# EAGLE design Powerswitch MUR3060 (EAGLE 9.6.2)
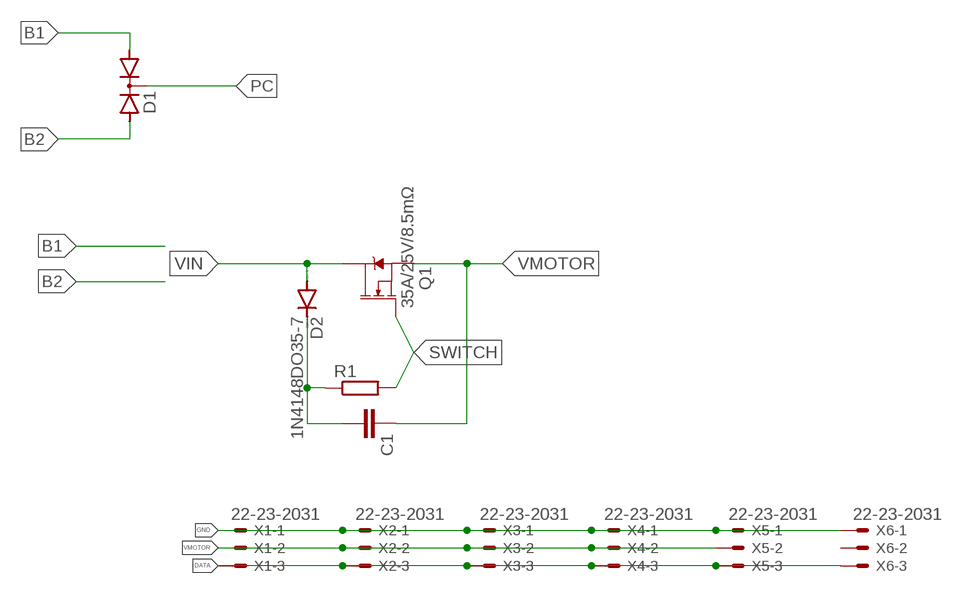
[diagram p0: schematic, sheet 1]

## Parts
C1  C-EU025-030X050  [C025-030X050]
D1  DIODE-2AC|CATO220H  [TO220AB]
D2  1N4148DO35-7  [DO35-7]
Q1  35A/25V/8.5mΩ  MOSFET-NCH-FDD8780  [DPAK]
R1  R-EU_0207/10  [0207/10]
X1  22-23-2031  [22-23-2031]
X2  22-23-2031  [22-23-2031]
X3  22-23-2031  [22-23-2031]
X4  22-23-2031  [22-23-2031]
X5  22-23-2031  [22-23-2031]
X6  22-23-2031  [22-23-2031]

## Nets
B1: D1.A1
B2: D1.A2
DATA: X1.3 X2.3 X3.3 X4.3 X5.3 X6.3
GND: X1.1 X2.1 X3.1 X4.1 X5.1 X6.1
N$5: C1.2 D2.C R1.1
PC: D1.C
SWITCH: Q1.1(G) R1.2
VIN: D2.A Q1.4(D)
VMOTOR: C1.1 Q1.3(S) X1.2 X2.2 X3.2 X4.2 X5.2
Unconnected: X6.2

## Library data of the parts
C1 = rcl:C-EU: CAPACITOR, European symbol; SPICEPREFIX: C
D1 = diode:DIODE-2AC|CA: Dual DIODE Anode-Cathode|Cathode-Anode
D2 = diode:1N4148: DIODE high speed (Philips)
Q1 = SparkFun-DiscreteSemi:MOSFET-NCH: N-channel MOSFETs Voltage controlled devices that allow control of high current outputs. SparkFun Products: SparkFun OpenScale <https://www.sparkfun.com/products/13261> SparkFun Digital Sandbox <https://www.sparkfun.com/products/12651> SparkFun Monster Moto Shield <https://www.sparkfun.com/products/10182> SparkFun MOSFET Power Controller <https://www.sparkfun.com/products/11214>; PROD_ID: TRANS-09984
R1 = rcl:R-EU_: RESISTOR, European symbol; SPICEPREFIX: R
X1-X6 = con-molex:22-23-2031: .100" (2.54mm) Center Header - 3 Pin; MF: MOLEX; MPN: 22-23-2031; OC_FARNELL: 1462950; OC_NEWARK: 30C0862

## Board
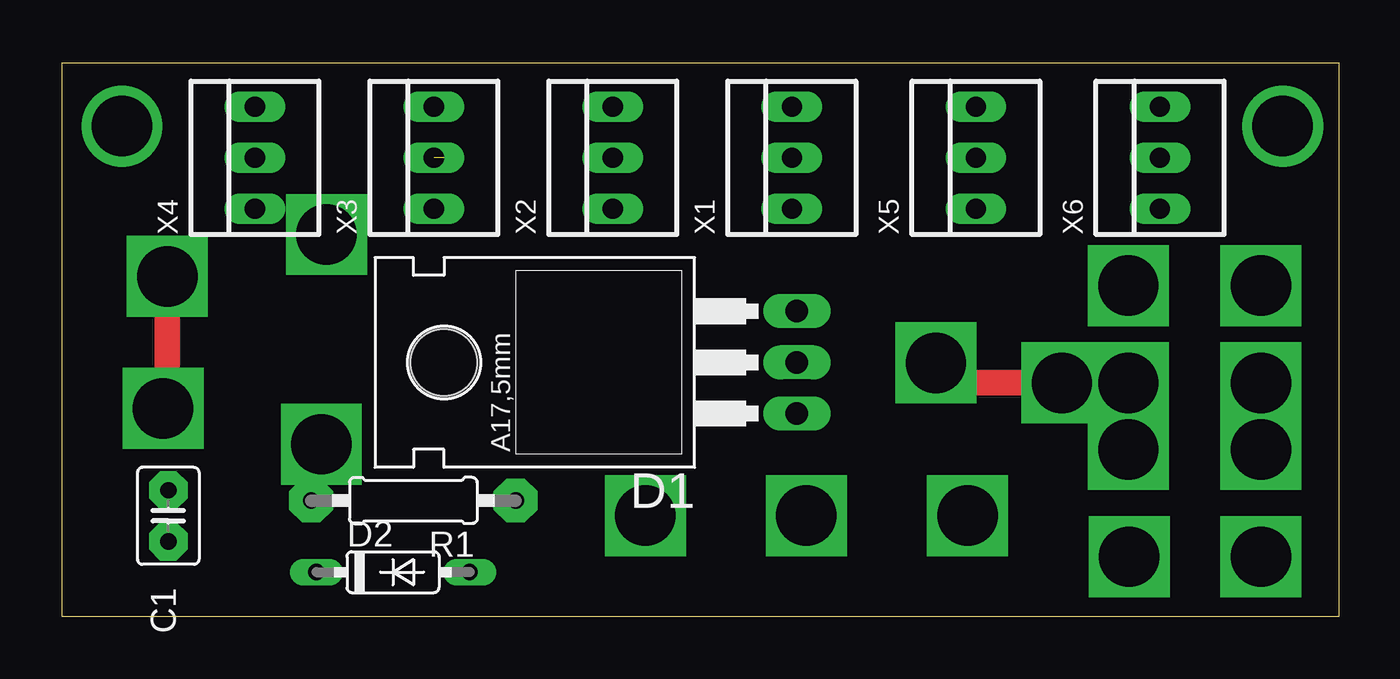
[diagram p1: board, top side]
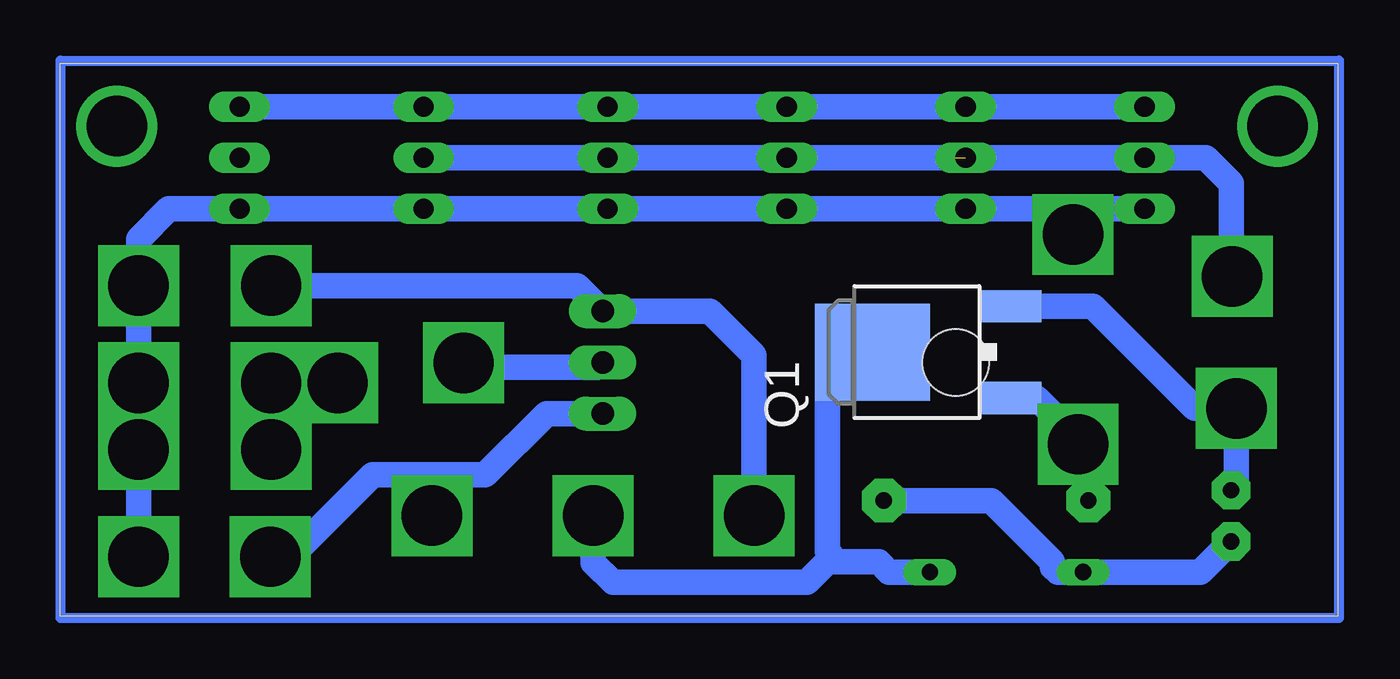
[diagram p2: board, bottom side, seen from below]

Size 63.46 x 27.46 mm. Coordinates in mm from the lower left corner, seen from the top.
Outline: 0,0 63.46,0 63.46,27.46 0,27.46 0,0
Copper layers (1*16): Top 0.035mm / dielectric 1.5mm / Bottom 0.035mm
Design rules "default": minimum track width 6mil, minimum drill 0.35mm, track to track 24mil, track to pad 24mil, pad to pad 24mil, via to via 24mil, smd to smd 24mil, copper to edge 40mil, drill to drill 6mil, minimum pad ring 10mil, minimum via ring 8mil, stop-mask expansion 4mil, vias tented up to drill 0mil, thermal gap 10mil

### Footprints (pad centres in the part's own frame; a part is rotated, then mirrored left to right if it is on the bottom)
C025-030X050 = drill 0.813 pad 1.905 octagon: 1 -1.27,0; 2 1.27,0
TO220AB = drill 1.118 long: A1 -2.54,-6.35; A2 2.54,-6.35; C 0,-6.35 | hole 3.302: 0,11.176
DO35-7 = drill 0.813 long: A 3.81,0; C -3.81,0
DPAK = smd 1.6 x 3: 1 -2.28,-5.31; 3 2.28,-5.31 | smd 4.826 x 5.715: 4 0,1.588
0207/10 = drill 0.813 pad 2.184 octagon: 1 -5.08,0; 2 5.08,0
22-23-2031 = drill 1 long: 1 -2.54,0; 2 0,0; 3 2.54,0

### Placement (x,y rotation side)
C1  5.3,4.99 270 top
D1  30.18,12.61 90 top
D2  16.46,2.19 0 top
Q1  21.54,13.11 90 bottom
R1  17.48,5.75 180 top
X1  36.27,22.77 90 top
X2  27.38,22.77 90 top
X3  18.49,22.77 90 top
X4  9.6,22.77 90 top
X5  45.42,22.77 90 top
X6  54.56,22.77 90 top

### Tracks (layer width: path | path; a pad name or v marks a point on that pad's centre or on a via)
B1  (via drill 3)
  Bottom 1.27: 44.91,7.02 42.37,7.02 39.32,10.07 D1.A1 | 44.91,7.02 47.96,7.02 52.02,2.95 v53.04,2.95 | v45,5 44.91,5.09 44.91,7.02
B2  (via drill 3)
  Bottom 1.27: v52.99,16.42 37.8,16.42 D1.A2 31.19,15.15 29,12.95 v29,5
DATA
  Bottom 1.27: X4.3 X3.3 X2.3 X1.3 X5.3 X6.3
GND  (via drill 3)
  Bottom 1.27: X4.1 12.4,20.23 | 12.4,20.23 13.67,20.23 | 13.67,20.23 X3.1 X2.1 X1.1 X5.1 51.01,20.23 X6.1 58.07,20.23 59.58,18.72 v59.58,16.42 v59.58,11.59 v59.58,8.29 v59.58,2.95 | 13.67,20.23 13.67,19.46 v13.16,18.96 12.4,19.72 12.4,20.23
N$1  (via drill 3 pad 3.1)
  other vias: 3,24.34
N$2  (via drill 3 pad 3.1)
  other vias: 60.66,24.34
N$3
  Bottom 0.508: -0.05,27.59 -0.05,-0.09 63.45,-0.09 63.45,27.59 -0.05,27.59
N$5
  Bottom 1.27: C1.2 6.83,2.19 D2.C 13.92,2.19 14.18,2.45 14.18,2.7 17.22,5.75 R1.1
PC  (via drill 3)
  Top 1.27: v43.43,12.59 44.43,11.59 v49.69,11.59
  Bottom 1.27: D1.C 36.77,12.37 43.22,12.37 v43.43,12.59 | v52.99,8.29 v52.99,11.59 v49.69,11.59
SWITCH  (via drill 3)
  Bottom 1.27: R1.2 12.42,8.31 12.91,8.8 | Q1.1 14.94,10.83 13.03,8.92 12.91,8.8 | v12.91,8.54 12.91,8.8
VIN  (via drill 3)
  Bottom 1.27: 20.53,2.19 D2.A 22.3,2.19 22.81,2.7 25.35,2.7 | Q1.4 24.34,13.11 25.35,12.1 25.35,3.21 25.1,2.95 25.35,2.7 | v37,5 37,2.66 36.02,1.68 26.37,1.68 25.35,2.7
VMOTOR  (via drill 3)  (1 unrouted)
  Top 1.27: v5.25,16.88 5.25,10.53 v5.05,10.32
  Bottom 1.27: 19,22.77 X4.2 6.56,22.77 5.29,21.5 5.29,16.91 v5.25,16.88 | X3.2 X2.2 X1.2 X5.2 | v5.05,10.32 5.05,9.3 | Q1.3 12.18,15.39 7.11,10.32 v5.05,10.32 | v5.05,10.32 5.05,6.51 C1.1